# Altium schematic sheet top_level.SchDoc
size A3; SheetNumber: 1; SheetTotal: 6
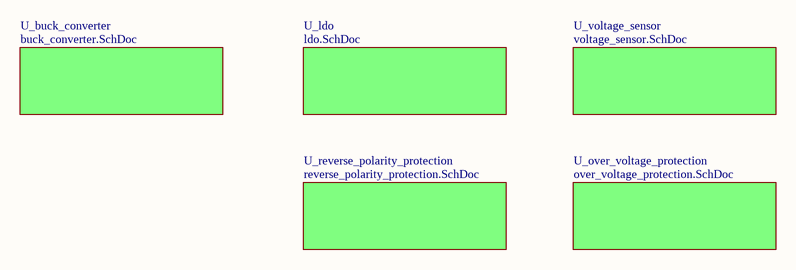
[diagram p0: top_level.SchDoc]

## Sub-sheets
U_buck_converter = buck_converter.SchDoc: no entries
U_ldo = ldo.SchDoc: no entries
U_over_voltage_protection = over_voltage_protection.SchDoc: no entries
U_reverse_polarity_protection = reverse_polarity_protection.SchDoc: no entries
U_voltage_sensor = voltage_sensor.SchDoc: no entries